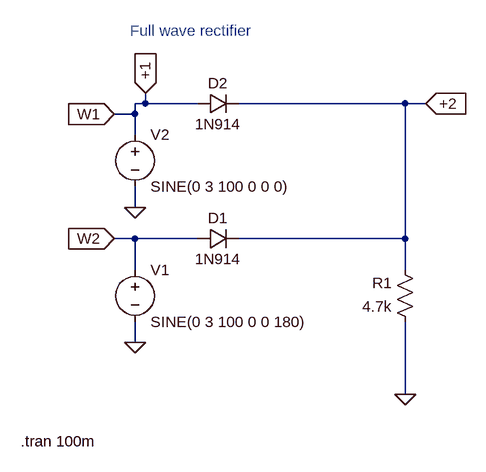
[diagram p0: schematic full_wave_rect.asc]
full_wave_rect.asc, the LTspice schematic file:
Version 4
SHEET 1 880 680
WIRE -160 0 -160 -16
WIRE -160 0 -176 0
WIRE -80 0 -160 0
WIRE 240 0 -16 0
WIRE 272 0 240 0
WIRE -176 16 -176 0
WIRE -176 16 -208 16
WIRE -176 48 -176 16
WIRE -176 160 -176 128
WIRE -176 208 -208 208
WIRE -80 208 -176 208
WIRE 240 208 240 0
WIRE 240 208 -16 208
WIRE -176 256 -176 208
WIRE 240 256 240 208
WIRE -176 368 -176 336
WIRE 240 448 240 336
FLAG 240 448 0
FLAG -176 160 0
FLAG -176 368 0
FLAG -160 -16 +1
IOPIN -160 -16 In
FLAG -208 16 W1
IOPIN -208 16 In
FLAG 272 0 +2
IOPIN 272 0 In
FLAG -208 208 W2
IOPIN -208 208 In
SYMBOL diode -80 224 R270
WINDOW 0 32 32 VTop 2
WINDOW 3 0 32 VBottom 2
SYMATTR InstName D1
SYMATTR Value 1N914
SYMBOL res 256 352 R180
WINDOW 0 36 76 Left 2
WINDOW 3 36 40 Left 2
SYMATTR InstName R1
SYMATTR Value 4.7k
SYMBOL voltage -176 240 R0
WINDOW 123 0 0 Left 0
WINDOW 39 0 0 Left 0
SYMATTR InstName V1
SYMATTR Value SINE(0 3 100 0 0 180)
SYMBOL diode -80 16 R270
WINDOW 0 32 32 VTop 2
WINDOW 3 0 32 VBottom 2
SYMATTR InstName D2
SYMATTR Value 1N914
SYMBOL voltage -176 32 R0
WINDOW 123 0 0 Left 0
WINDOW 39 0 0 Left 0
SYMATTR InstName V2
SYMATTR Value SINE(0 3 100 0 0 0)
TEXT -184 -112 Left 2 ;Full wave rectifier
TEXT -352 520 Left 2 !.tran 100m

The netlist it stands for:
* full_wave_rect.asc
D1 W2 +2 1N914
R1 0 +2 4.7k
V1 W2 0 SINE(0 3 100 0 0 180)
D2 W1 +2 1N914
V2 W1 0 SINE(0 3 100 0 0 0)
.model D D
.lib standard.dio
* Full wave rectifier
.tran 100m
.backanno
.end